# Altium schematic sheet LCD.SchDoc
size A4; DocumentNumber: 5; SheetNumber: 5; SheetTotal: 7
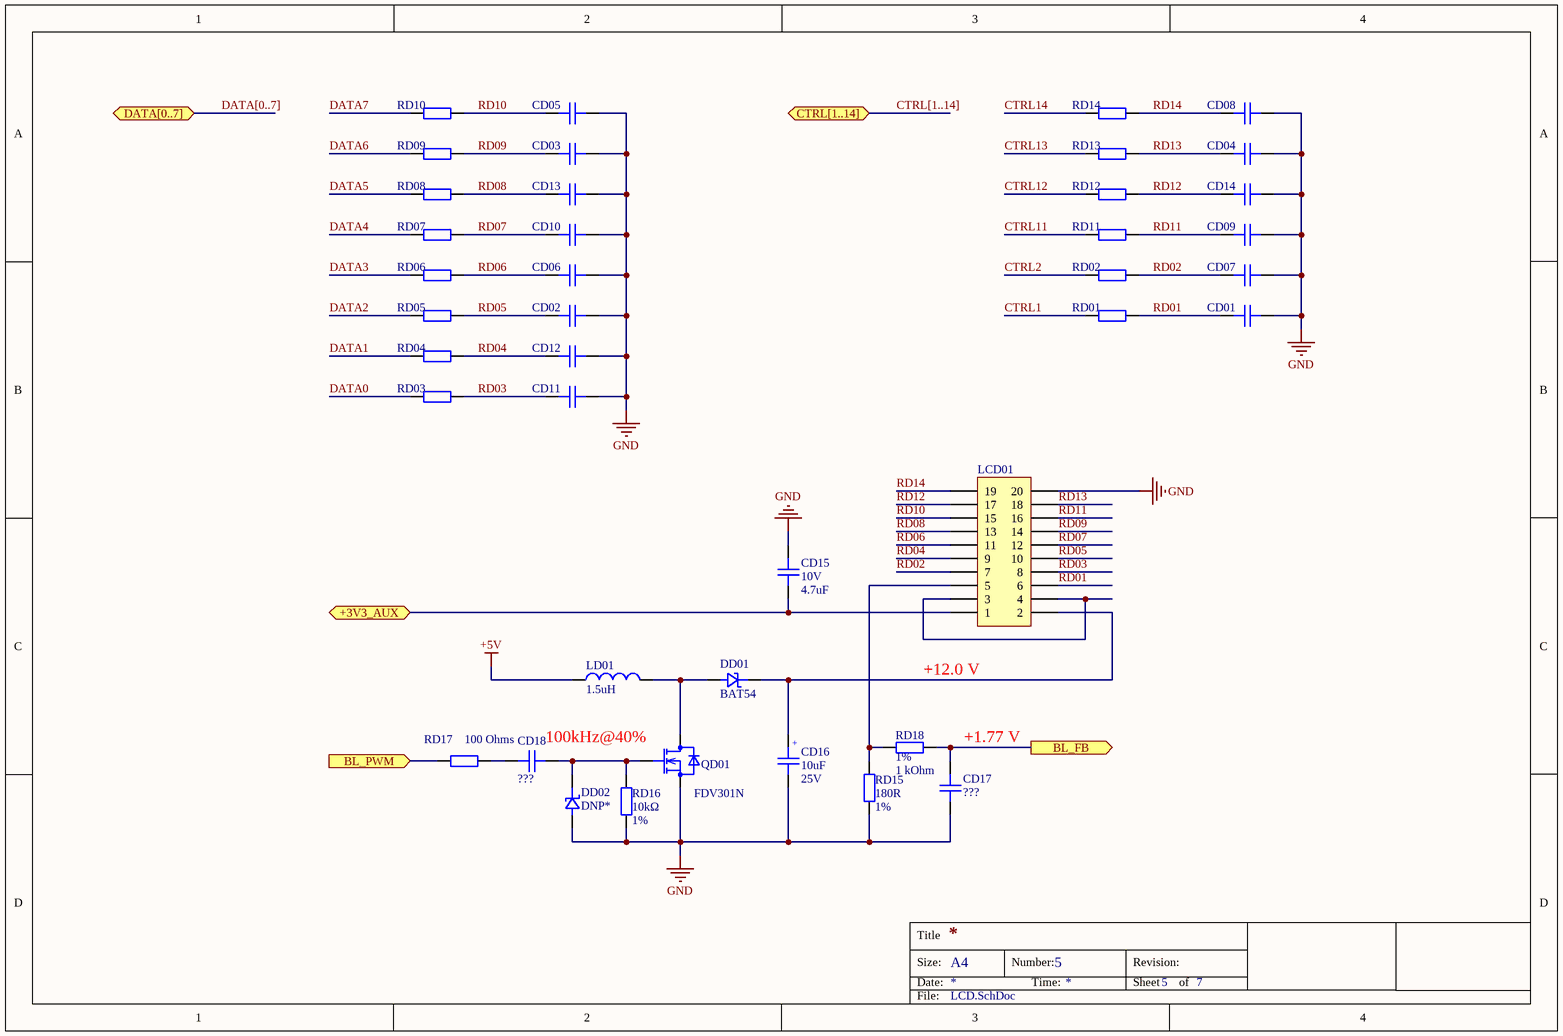
[diagram p0: LCD.SchDoc]

## Parts
CD01  CAP CER 120PF 50V C0G/NP0 0603  [0603C]  (value not drawn)
CD02  CAP CER 120PF 50V C0G/NP0 0603  [0603C]  (value not drawn)
CD03  CAP CER 120PF 50V C0G/NP0 0603  [0603C]  (value not drawn)
CD04  CAP CER 120PF 50V C0G/NP0 0603  [0603C]  (value not drawn)
CD05  CAP CER 120PF 50V C0G/NP0 0603  [0603C]  (value not drawn)
CD06  CAP CER 120PF 50V C0G/NP0 0603  [0603C]  (value not drawn)
CD07  CAP CER 120PF 50V C0G/NP0 0603  [0603C]  (value not drawn)
CD08  CAP CER 120PF 50V C0G/NP0 0603  [0603C]  (value not drawn)
CD09  CAP CER 120PF 50V C0G/NP0 0603  [0603C]  (value not drawn)
CD10  CAP CER 120PF 50V C0G/NP0 0603  [0603C]  (value not drawn)
CD11  CAP CER 120PF 50V C0G/NP0 0603  [0603C]  (value not drawn)
CD12  CAP CER 120PF 50V C0G/NP0 0603  [0603C]  (value not drawn)
CD13  CAP CER 120PF 50V C0G/NP0 0603  [0603C]  (value not drawn)
CD14  CAP CER 120PF 50V C0G/NP0 0603  [0603C]  (value not drawn)
CD15  Voltage Rating: 10V  Capacitance: 4.7uF  [0603C]  (hidden comment: CAP CER 4.7UF 10V X5R 0603)
CD16  Capacitance: 10uF  Rated Voltage: 25V  [WCAP-ASLI_6.3x5.5]  (hidden comment: CAP ALUM 68 UF 20% 25 V SMD)
CD17  Capacitance: ???  [CAPC1608X08N_0603]  (hidden comment: CAP CER 0.1uF ±10% 50V X7R 0603)
CD18  Capacitance: ???  [CAPC1608X08N_0603]  (hidden comment: CAP CER 0.1uF ±10% 50V X7R 0603)
DD01  BAT54  [SOT100P240X120-3N]
DD02  DNP*  [SOT100P240X120-3N]
LCD01  CONN HEADER SMD 20POS 2.54MM  [IDC_2X10 SMD]  (value not drawn)
LD01  Inductance: 1.5uH  (hidden comment: FIXED IND 1.5UH 6.2A 20 MOHM SMD)
QD01  FDV301N  [SOT-23/3]
RD01  100 Ohms  [R_0603]  (value not drawn)
RD02  100 Ohms  [R_0603]  (value not drawn)
RD03  100 Ohms  [R_0603]  (value not drawn)
RD04  100 Ohms  [R_0603]  (value not drawn)
RD05  100 Ohms  [R_0603]  (value not drawn)
RD06  100 Ohms  [R_0603]  (value not drawn)
RD07  100 Ohms  [R_0603]  (value not drawn)
RD08  100 Ohms  [R_0603]  (value not drawn)
RD09  100 Ohms  [R_0603]  (value not drawn)
RD10  100 Ohms  [R_0603]  (value not drawn)
RD11  100 Ohms  [R_0603]  (value not drawn)
RD12  100 Ohms  [R_0603]  (value not drawn)
RD13  100 Ohms  [R_0603]  (value not drawn)
RD14  100 Ohms  [R_0603]  (value not drawn)
RD15  Resistance: 180R  Tolerance: 1%  [Resistor-0603]  (hidden comment: R 180Ω ±5% 0603 0.1W)
RD16  Resistance: 10kΩ  Tolerance: 1%  [R0603]  (hidden comment: RES SMD 10K OHM 1% 1/10W 0603)
RD17  100 Ohms  [R_0603]
RD18  Tolerance: 1%  Resistance: 1 kOhm  [R0603]  (hidden comment: 1 kOhms ±1% 0.1W, 1/10W Chip Resistor 0603 (1608 Metric) Moisture Resistant Thick Film)  (no BOM)

## Ports
+3V3_AUX, BL_FB (out), BL_PWM (in), CTRL[1..14], DATA[0..7]

## Nets
+5V: LD01.1
GND: CD01.2 CD02.2 CD03.2 CD04.2 CD05.2 CD06.2 CD07.2 CD08.2 CD09.2 CD10.2 CD11.2 CD12.2 CD13.2 CD14.2 CD15.1 CD16.2 CD17.2 DD02.1 LCD01.20 QD01.2(S) RD15.1 RD16.1
+3V3_AUX: CD15.2 LCD01.1 ; port +3V3_AUX
BL_FB: CD17.1 RD18.2 ; port BL_FB
BL_PWM: RD17.2 ; port BL_PWM
CTRL1: RD01.1
CTRL2: RD02.2
CTRL11: RD11.1
CTRL12: RD12.2
CTRL13: RD13.1
CTRL14: RD14.2
DATA0: RD03.1
DATA1: RD04.2
DATA2: RD05.1
DATA3: RD06.2
DATA4: RD07.1
DATA5: RD08.2
DATA6: RD09.1
DATA7: RD10.2
RD01: CD01.1 LCD01.6 RD01.2
RD02: CD07.1 LCD01.7 RD02.1
RD03: CD11.1 LCD01.8 RD03.2
RD04: CD12.1 LCD01.9 RD04.1
RD05: CD02.1 LCD01.10 RD05.2
RD06: CD06.1 LCD01.11 RD06.1
RD07: CD10.1 LCD01.12 RD07.2
RD08: CD13.1 LCD01.13 RD08.1
RD09: CD03.1 LCD01.14 RD09.2
RD10: CD05.1 LCD01.15 RD10.1
RD11: CD09.1 LCD01.16 RD11.2
RD12: CD14.1 LCD01.17 RD12.1
RD13: CD04.1 LCD01.18 RD13.2
RD14: CD08.1 LCD01.19 RD14.1
NetCD16_1: CD16.1 DD01.3 LCD01.2
NetCD18_1: CD18.1 DD02.3 QD01.1(G) RD16.2
NetCD18_2: CD18.2 RD17.1
NetDD01_1: DD01.1 LD01.2 QD01.3(D)
NetLCD01_3: LCD01.3 LCD01.4
NetLCD01_5: LCD01.5 RD15.2 RD18.1

## Buses and harness runs
bus CTRL[1..14] = port CTRL[1..14]
bus DATA[0..7] = port DATA[0..7]

## Notes on the sheet
- +12.0 V
- 100kHz@40%
- +1.77 V
- Title
- Size:
- Date:
- A4
- Number:
- Time:
- Revision:
- Sheet
- of
- File:
- (in symbol CAP ALUM 68 UF 20% 25 V SMD) +

## Library data of the parts
CD01 CD02 CD03 CD04 CD05 CD06 CD07 CD08 CD09-CD14 = CAP CER 120PF 50V C0G/NP0 0603: 120pF ±5% 50V Ceramic Capacitor C0G, NP0 0603 (1608 Metric); Manufacturer: KEMET; Manufacturer Part Number: C0603C121J5GACTU; Temperature Coefficient: 30ppm/°C; Dissipation Factor: 0.1%; Supplier 1: Digi-Key; Stock 1: 25376; Pricing 1: 1=0.1, 10=0.061, 100=0.0273, 500=0.0195, 1000=0.0153 (USD); Mount: Surface Mount,PCB; Number of Pins: 2; Case Code (Metric): 1608; Case Code (Imperial): 0603; Dielectric Material: Ceramic; Contact Material: Tin; Contact Plating: Tin,Matte; Min Operating Temperature: -55°C; Max Operating Temperature: 125°C; Tolerance: 5%; Voltage Rating (DC): 50V; Packaging: Tape and Reel; Dielectric: C0G; Termination: SMD/SMT; Voltage Rating: 50V; Package Quantity: 1; Length: 1.6mm; Height: 0.8mm; Width: 0.8mm; Thickness: 0.034inch; Lead Pitch: 0.7mm; Depth: 0.8mm; Radiation Hardening: No; Lead Free: Lead Free; REACH SVHC: No SVHC; ComponentLink1URL: https://www.verical.com/server-webapp/html/getDatasheet?partID=462848&src-supplier=Verical; ComponentLink1Description: https://www.verical.com/server-webapp/html/getDatasheet?partID=462848&src-supplier=Verical; ComponentLink2URL: https://api.kemet.com/component-edge/download/datasheet/C0603C121J5GACTU.pdf?src-supplier=Digi-Key; ComponentLink2Description: https://api.kemet.com/component-edge/download/datasheet/C0603C121J5GACTU.pdf?src-supplier=Digi-Key; ComponentLink3URL: https://www.alliedelec.com/m/d/9bfe7773041ffe9d406e68bc7b377fdd.pdf?src-supplier=Allied+Electronics; ComponentLink3Description: https://www.alliedelec.com/m/d/9bfe7773041ffe9d406e68bc7b377fdd.pdf?src-supplier=Allied+Electronics; ComponentLink4URL: http://www.mouser.com/ds/2/212/KEM_C1003_C0G_SMD-1101588.pdf?src-supplier=Mouser; ComponentLink4Description: http://www.mouser.com/ds/2/212/KEM_C1003_C0G_SMD-1101588.pdf?src-supplier=Mouser; Supplier Part Number 1: 399-1062-1-ND; Case/Package: 0603; Voltage: 50V; Capacitance: 120pF
CD15 = CAP CER 4.7UF 10V X5R 0603: 4.7µF ±10% 10V Ceramic Capacitor X5R 0603 (1608 Metric); Manufacturer: Yageo; Manufacturer Part Number: CC0603KRX5R6BB475; Supplier 1: Digi-Key; Stock 1: 325858; Pricing 1: 1=0.26, 10=0.18, 100=0.102, 500=0.072, 1000=0.063 (USD); Mount: Surface Mount; Case Code (Imperial): 0603; Case Code (Metric): 1608; Min Operating Temperature: -55°C; Max Operating Temperature: 85°C; Voltage Rating (DC): 10V; Tolerance: 10%; Packaging: Tape and Reel; Package Quantity: 1; Dielectric: X5R; Termination: SMD/SMT; Composition: Ceramic; Length: 1.6mm; Height: 0.8mm; Width: 0.8mm; Thickness: 0.035inch; Depth: 0.8mm; Radiation Hardening: No; REACH SVHC: Unknown; Lead Free: Lead Free; Halogen Free: Halogen Free; ComponentLink1URL: http://www.farnell.com/datasheets/2167237.pdf?src-supplier=Element14; ComponentLink1Description: http://www.farnell.com/datasheets/2167237.pdf?src-supplier=Element14; ComponentLink2URL: http://www.yageo.com/documents/recent/UPY-GPHC_X5R_4V-to-50V_25.pdf?src-supplier=Digi-Key; ComponentLink2Description: http://www.yageo.com/documents/recent/UPY-GPHC_X5R_4V-to-50V_25.pdf?src-supplier=Digi-Key; ComponentLink3URL: http://www.yageo.com/documents/recent/UPY-GPHC_X5R_4V-to-50V_12.pdf?src-supplier=Avnet; ComponentLink3Description: http://www.yageo.com/documents/recent/UPY-GPHC_X5R_4V-to-50V_12.pdf?src-supplier=Avnet; ComponentLink4URL: http://www.yageo.com/documents/recent/UPY-GPHC_X5R_4V-to-50V_12.pdf?src-supplier=Avnet+Europe; ComponentLink4Description: http://www.yageo.com/documents/recent/UPY-GPHC_X5R_4V-to-50V_12.pdf?src-supplier=Avnet+Europe; Supplier Part Number 1: 311-1455-1-ND; Case/Package: 0603
CD16 = CAP ALUM 68 UF 20% 25 V SMD: 68µF 25V Aluminum Electrolytic Capacitors Radial, Can - SMD  2000 Hrs @ 105°C; Manufacturer Part Number: 865080443009; Manufacturer: Wurth Elektronik; Dissipation Factor: 14%; Endurance: 2000h; Leakage Current: 17uA; Ripple Current: 240mA; Capacitance Tolerance: +/-20%; Technical Reference: ASED055680M025DVCTBB000; ComponentLink1Description: Manufacturer; ComponentLink1URL: http://www.we-online.de; ComponentLink2Description: Datasheet; ComponentLink2URL: https://www.we-online.com/catalog/datasheet/865080443009.pdf; Height: 5.5mm; Mounting Technology: SMT; Operating Temperature: -55 to +105degC; Packaging: Tape and Reel; Published Date: May 2020; Diameter: 6.3mm; Supplier 1: Digi-Key; Supplier Part Number 1: 732-8437-1-ND
CD17 CD18 = CAP CER 0.1uF ±10% 50V X7R 0603: Capacitor; Manufacturer: KEMET; Manufacturer Part Number: C0603C104M5RACTU; Dielectric Material: Ceramic; Tolerance: 20%; Dissipation Factor: 2.5%; Supplier 1: Digi-Key; Stock 1: 1202175; Pricing 1: 1=0.1, 10=0.039, 50=0.0204, 100=0.0174, 500=0.0124, 1000=0.0097 (USD); Mount: Surface Mount,PCB; Case/Package: 0603; Case Code (Metric): 1608; Case Code (Imperial): 0603; Contact Plating: Tin,Matte; Min Operating Temperature: -55°C; Max Operating Temperature: 125°C; Package Quantity: 1; Packaging: Tape and Reel; Voltage Rating (DC): 50V; Dielectric: X7R; Termination: SMD/SMT; Length: 1.6mm; Height: 0.8mm; Width: 0.031inch; Thickness: 0.034inch; Lead Pitch: 0.7mm; Depth: 0.8mm; Radiation Hardening: No; REACH SVHC: No SVHC; ComponentLink1URL: http://www.farnell.com/datasheets/2746056.pdf?src-supplier=Element14; ComponentLink1Description: http://www.farnell.com/datasheets/2746056.pdf?src-supplier=Element14; ComponentLink2URL: http://www.mouser.com/ds/2/212/KEM_C1002_X7R_SMD-1102033.pdf?src-supplier=Mouser; ComponentLink2Description: http://www.mouser.com/ds/2/212/KEM_C1002_X7R_SMD-1102033.pdf?src-supplier=Mouser; ComponentLink3URL: https://www.verical.com/server-webapp/html/getDatasheet?partID=626892&src-supplier=Verical; ComponentLink3Description: https://www.verical.com/server-webapp/html/getDatasheet?partID=626892&src-supplier=Verical; ComponentLink4URL: http://components.arrow.com/part/dataview/40911037S8853915N7429?src-supplier=Arrow; ComponentLink4Description: http://components.arrow.com/part/dataview/40911037S8853915N7429?src-supplier=Arrow; ComponentLink5URL: http://capacitoredge.kemet.com/capedge2/DataSheet?pn=C0603C104M5RAC7867&src-supplier=Avnet; ComponentLink5Description: http://capacitoredge.kemet.com/capedge2/DataSheet?pn=C0603C104M5RAC7867&src-supplier=Avnet; ComponentLink6URL: http://capacitoredge.kemet.com/capedge2/DataSheet?pn=C0603C104M5RAC7867&src-supplier=Avnet+Asia; ComponentLink6Description: http://capacitoredge.kemet.com/capedge2/DataSheet?pn=C0603C104M5RAC7867&src-supplier=Avnet+Asia; ComponentLink7URL: http://www.farnell.com/datasheets/2746056.pdf?src-supplier=Farnell; ComponentLink7Description: http://www.farnell.com/datasheets/2746056.pdf?src-supplier=Farnell; ComponentLink8URL: http://www.farnell.com/datasheets/2746056.pdf?src-supplier=Newark; ComponentLink8Description: http://www.farnell.com/datasheets/2746056.pdf?src-supplier=Newark; ComponentLink9URL: http://www.alliedelec.com/m/d/6f3b5eb83d09db50ed28bdc730567b33.pdf?src-supplier=Allied+Electronics; ComponentLink9Description: http://www.alliedelec.com/m/d/6f3b5eb83d09db50ed28bdc730567b33.pdf?src-supplier=Allied+Electronics; ComponentLink10URL: https://api.kemet.com/component-edge/download/datasheet/C0603C104M5RACTU.pdf?src-supplier=Digi-Key; ComponentLink10Description: https://api.kemet.com/component-edge/download/datasheet/C0603C104M5RACTU.pdf?src-supplier=Digi-Key; ComponentLink11URL: http://www.farnell.com/datasheets/2315113.pdf?src-supplier=Newark; ComponentLink11Description: http://www.farnell.com/datasheets/2315113.pdf?src-supplier=Newark; ComponentLink12URL: http://www.farnell.com/datasheets/1828800.pdf?src-supplier=Newark; ComponentLink12Description: http://www.farnell.com/datasheets/1828800.pdf?src-supplier=Newark; ComponentLink13URL: http://components.arrow.com/part/dataview/0323_00313986?src-supplier=Arrow+Europe; ComponentLink13Description: http://components.arrow.com/part/dataview/0323_00313986?src-supplier=Arrow+Europe; ComponentLink14URL: https://www.verical.com/server-webapp/html/getDatasheet?partID=110138&src-supplier=Verical; ComponentLink14Description: https://www.verical.com/server-webapp/html/getDatasheet?partID=110138&src-supplier=Verical; Supplier Part Number 1: 399-7845-1-ND; Voltage Rating: 50V
DD01 DD02 = BAT54: Schottky DiodeS
LCD01 = CONN HEADER SMD 20POS 2.54MM: Connector Header Surface Mount 20 position 0.100" (2.54mm); Manufacturer: CNC Tech; Manufacturer Part Number: 3020-20-0300-00; Number of Positions: 20; Connector Type: Male Pin; Pitch: 0.1inch; Supplier 1: Digi-Key; Stock 1: 575; Pricing 1: 1=0.81, 10=0.714, 100=0.616, 500=0.504, 1000=0.448, 5000=0.392, 10000=0.3724 (USD); Mount: Surface Mount; Contact Plating: Gold; Package Quantity: 960; Number of Rows: 2; Packaging: Tray; Termination: Solder; Row Spacing: 0.1inch; ComponentLink1URL: http://cnctech.us/idcmatching2.pdf?src-supplier=Digi-Key; ComponentLink1Description: http://cnctech.us/idcmatching2.pdf?src-supplier=Digi-Key; Supplier Part Number 1: 1175-1623-ND
LD01 = FIXED IND 1.5UH 6.2A 20 MOHM SMD: 1.5µH Shielded Molded Inductor 6.2A 20mOhm Max Nonstandard; Manufacturer: Wurth Electronics; Manufacturer Part Number: 74438357015; Core Material: Metal,Composite; Tolerance: 20%; Saturation Current: 8.5A; DC Resistance (DCR): 20mR; Self Resonant Frequency: 48MHz; Test Frequency: 100kHz; Supplier 1: Digi-Key; Stock 1: 2769; Pricing 1: 1=1.58, 10=1.507, 50=1.452, 100=1.32 (USD); Mount: Surface Mount; Case/Package: Nonstandard; Min Operating Temperature: -40°C; Max Operating Temperature: 125°C; Packaging: Tape and Reel; Current Rating: 6.2A; Shielding: Shielded; ComponentLink1URL: http://www.farnell.com/datasheets/2579567.pdf?src-supplier=Farnell; ComponentLink1Description: http://www.farnell.com/datasheets/2579567.pdf?src-supplier=Farnell; ComponentLink2URL: http://www.farnell.com/datasheets/2579567.pdf?src-supplier=Newark; ComponentLink2Description: http://www.farnell.com/datasheets/2579567.pdf?src-supplier=Newark; ComponentLink3URL: https://katalog.we-online.de/pbs/datasheet/74438357015.pdf?src-supplier=Digi-Key; ComponentLink3Description: https://katalog.we-online.de/pbs/datasheet/74438357015.pdf?src-supplier=Digi-Key; Supplier Part Number 1: 732-11199-1-ND
QD01 = MOSFET FDV301N N-CH 25V 220MA SOT23: N-Channel 25 V 220mA (Ta) 350mW (Ta) Surface Mount SOT-23-3
RD01 RD02 RD03 RD04 RD05 RD06 RD07 RD08 RD09-RD14 RD17 = RES_SMD_100_OHM_1%_1/8W_0603: RES SMD 100 OHM 1% 1/8W 0603; PartNumber: MCT06030C1000FP500; Manufacturer: Vishay Beyschlag; Link: https://www.digikey.com/product-detail/en/vishay-beyschlag/MCT06030C1000FP500/MCT0603-100-CFCT-ND/2607874; Digi-KeyPartNumber: MCT0603-100-CFCT-ND; Value: 100 Ohms
RD15 = R 180Ω ±5% 0603 0.1W: Resistor; Manufacturer: Stackpole Electronics; Manufacturer Part Number: RMCF0603FT180R; Max Power Dissipation: 100mW; Temperature Coefficient: 100ppm/°C; Supplier 1: Digi-Key; Stock 1: 93001; Pricing 1: 1=0.1, 10=0.016, 100=0.0065, 1000=0.0029, 2500=0.0025 (USD); Mount: Surface Mount; Case/Package: 0603; Case Code (Metric): 1608; Case Code (Imperial): 0603; Contact Plating: Tin,Matte; Min Operating Temperature: -55°C; Max Operating Temperature: 155°C; Packaging: Tape and Reel; Composition: Thick Film; Number of Terminations: 2; Features: Automotive AEC-Q200; Length: 0.061inch; Height: 0.022inch; Width: 0.031inch; Radiation Hardening: No; ComponentLink1URL: https://www.seielect.com/Catalog/SEI-RMCF_RMCP.pdf?src-supplier=Digi-Key; ComponentLink1Description: https://www.seielect.com/Catalog/SEI-RMCF_RMCP.pdf?src-supplier=Digi-Key; ComponentLink2URL: https://www.seielect.com/catalog/SEI-Packaging.pdf?src-supplier=Digi-Key; ComponentLink2Description: https://www.seielect.com/catalog/SEI-Packaging.pdf?src-supplier=Digi-Key; ComponentLink3URL: https://www.seielect.com/catalog/SEI-RMCF_RMCP.pdf?src-supplier=Avnet; ComponentLink3Description: https://www.seielect.com/catalog/SEI-RMCF_RMCP.pdf?src-supplier=Avnet; Supplier Part Number 1: RMCF0603FT180RCT-ND
RD16 = RES SMD 10K OHM 1% 1/10W 0603: 10 kOhms ±1% 0.1W, 1/10W Chip Resistor 0603 (1608 Metric)  Thick Film; Manufacturer: Yageo; Manufacturer Part Number: RC0603FR-0710KL; Temperature Coefficient: 100ppm/°C; Voltage Rating: 75V; Power Rating: 100mW; Voltage Rating (DC): 50V; Supplier 1: Digi-Key; Stock 1: 81498627; Pricing 1: 1=0.1, 10=0.024, 100=0.0097, 1000=0.0044, 2500=0.0038 (USD); Case/Package: 0603; Number of Pins: 2; Weight: 7.1E-05oz; Case Code (Imperial): 0603; Case Code (Metric): 1608; Min Operating Temperature: -55°C; Max Operating Temperature: 155°C; Packaging: Tape and Reel; Composition: Thick Film; Military Standard: Not; Termination: SMD/SMT; Length: 1.6mm; Height: 0.45mm; Width: 0.8mm; Depth: 0.8mm; Lead Pitch: 0.3mm; Lead Free: Lead Free; REACH SVHC: No SVHC; ComponentLink1URL: http://www.farnell.com/datasheets/38590.pdf?src-supplier=Element14; ComponentLink1Description: http://www.farnell.com/datasheets/38590.pdf?src-supplier=Element14; ComponentLink2URL: https://www.verical.com/server-webapp/html/getDatasheet?partID=409289&src-supplier=Verical; ComponentLink2Description: https://www.verical.com/server-webapp/html/getDatasheet?partID=409289&src-supplier=Verical; ComponentLink3URL: http://www.farnell.com/datasheets/1868787.pdf?src-supplier=Element14; ComponentLink3Description: http://www.farnell.com/datasheets/1868787.pdf?src-supplier=Element14; ComponentLink4URL: http://www.farnell.com/datasheets/2167052.pdf?src-supplier=Element14; ComponentLink4Description: http://www.farnell.com/datasheets/2167052.pdf?src-supplier=Element14; ComponentLink5URL: http://www.farnell.com/datasheets/443971.pdf?src-supplier=Element14; ComponentLink5Description: http://www.farnell.com/datasheets/443971.pdf?src-supplier=Element14; Supplier Part Number 1: 311-10.0KHRCT-ND
RD18 = RES SMD 1K OHM 1% 1/10W 0603: Manufacturer: Yageo; Manufacturer Part Number: RC0603FR-071KL; Temperature Coefficient: 100ppm/°C; Power Rating: 100mW; Voltage Rating: 50V; Supplier 1: Digi-Key; Stock 1: 39344753; Pricing 1: 1=0.1, 10=0.023, 100=0.0094, 1000=0.0042, 2500=0.0037 (USD); Contact Plating: Tin,Matte; Case Code (Imperial): 0603; Case Code (Metric): 1608; Min Operating Temperature: -55°C; Max Operating Temperature: 155°C; Composition: Thick Film; Packaging: Tape and Reel; Termination: SMD/SMT; Military Standard: Not; Length: 1.6mm; Height: 0.45mm; Depth: 0.8mm; Radiation Hardening: No; REACH SVHC: No SVHC; Lead Free: Lead Free; ComponentLink1URL: http://documents.rs-components.com/techlib://itc_doclist_GB.htm?stockno=5048928&src-supplier=RSComponents; ComponentLink1Description: http://documents.rs-components.com/techlib://itc_doclist_GB.htm?stockno=5048928&src-supplier=RSComponents; ComponentLink2URL: http://www.yageo.com/documents/recent/PYu-RC0603_51_RoHS_L_4.pdf?src-supplier=Avnet+Europe; ComponentLink2Description: http://www.yageo.com/documents/recent/PYu-RC0603_51_RoHS_L_4.pdf?src-supplier=Avnet+Europe; ComponentLink3URL: http://www.farnell.com/datasheets/2167052.pdf?src-supplier=Element14; ComponentLink3Description: http://www.farnell.com/datasheets/2167052.pdf?src-supplier=Element14; ComponentLink4URL: http://www.farnell.com/datasheets/1868787.pdf?src-supplier=Element14; ComponentLink4Description: http://www.farnell.com/datasheets/1868787.pdf?src-supplier=Element14; ComponentLink5URL: http://www.yageo.com/documents/recent/PYu-RC_Group_51_RoHS_L_2.pdf?src-supplier=Avnet; ComponentLink5Description: http://www.yageo.com/documents/recent/PYu-RC_Group_51_RoHS_L_2.pdf?src-supplier=Avnet; ComponentLink6URL: https://www.verical.com/server-webapp/html/getDatasheet?partID=404327&src-supplier=Verical; ComponentLink6Description: https://www.verical.com/server-webapp/html/getDatasheet?partID=404327&src-supplier=Verical; ComponentLink7URL: http://www.farnell.com/datasheets/443971.pdf?src-supplier=Element14; ComponentLink7Description: http://www.farnell.com/datasheets/443971.pdf?src-supplier=Element14; Supplier Part Number 1: 311-1.00KHRDKR-ND; Case/Package: 0603